# Altium schematic sheet Sheet1.SchDoc
size A3
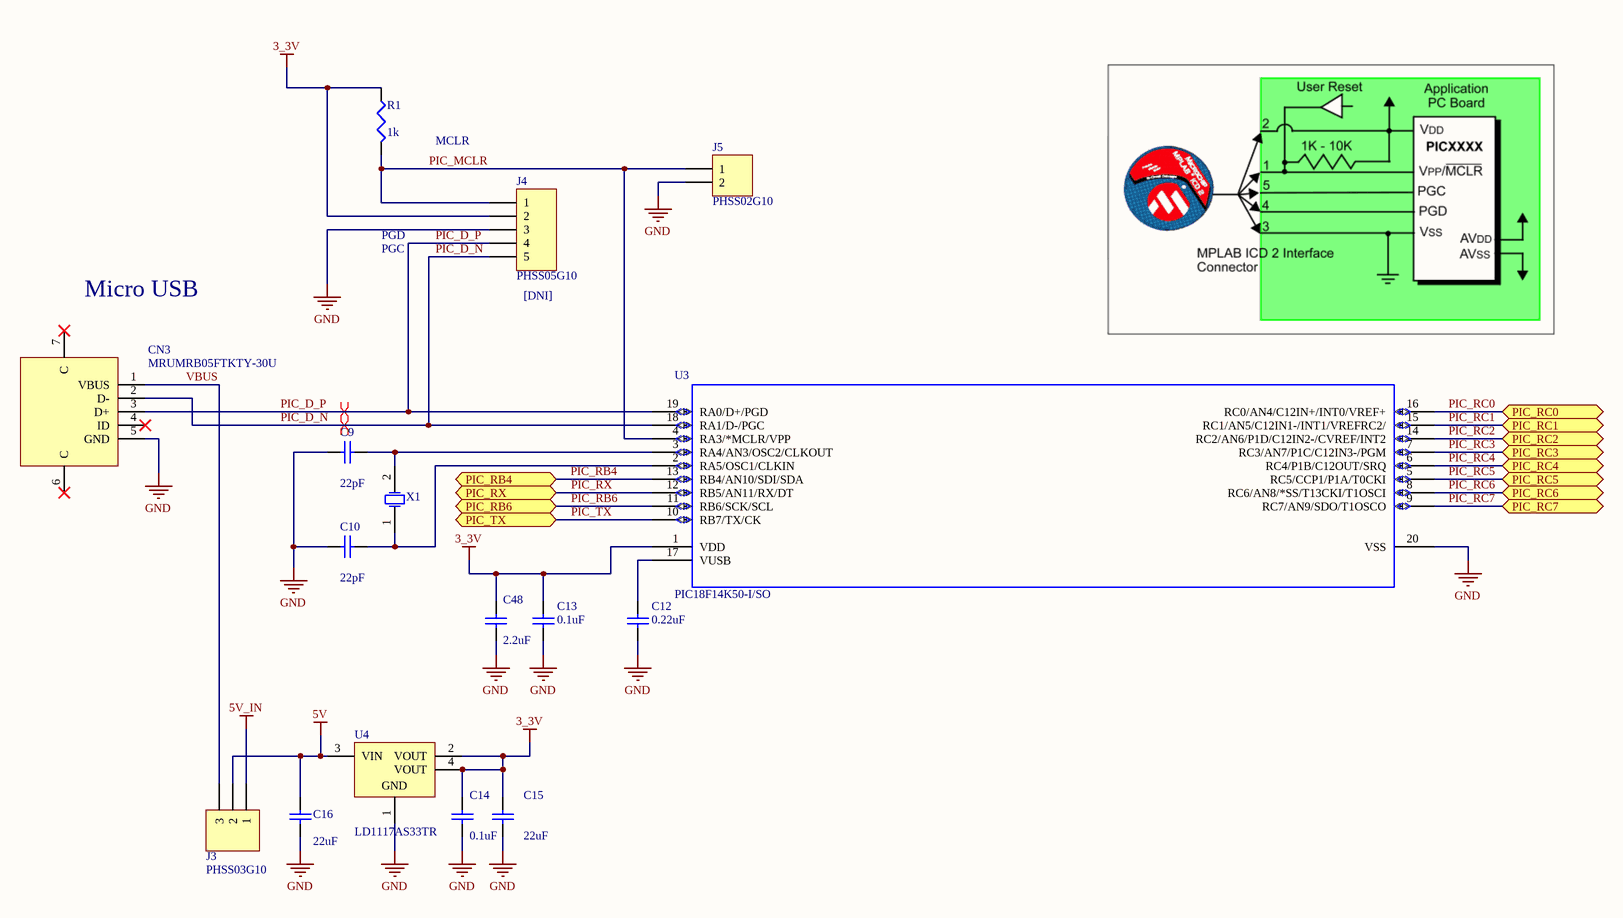
[diagram p0: Sheet1.SchDoc]

## Parts
C9  value 22pF  [CHIP1608]  (hidden comment: 06035A220JAT2A)
C10  value 22pF  [CHIP1608]  (hidden comment: 06035A220JAT2A)
C12  value 0.22uF  [CHIP1608]  (hidden comment: CC0603ZRY5V7BB224)
C13  value 0.1uF  [CHIP1608]  (hidden comment: MC0603B104M160CT)
C14  value 0.1uF  [CHIP1608]  (hidden comment: MC0603B104M160CT)
C15  value 22uF  [CHIP3216]  (hidden comment: MC1206F226Z100CT)
C16  value 22uF  [CHIP3216]  (hidden comment: MC1206F226Z100CT)
C48  value 2.2uF  [CHIP1608]  (hidden comment: MC0603B225K6R3CT)
CN3  MRUMRB05FTKTY-30U  [MRUMRB05FTKTY-30U]
J3  PHSS03G10  [HDR1X3]
J4  PHSS05G10  assembly: [DNI]  [HDR1X5]
J5  PHSS02G10  [HDR1X2]
R1  value 1k  [CHIP1608]  (hidden comment: MCMR06X1001FTL)
U3  PIC18F14K50-I/SO  [PIC18F14K50-SO]
U4  LD1117AS33TR  [SOT-223_N]
X1  SMD49S-12M1630F  [ABLS-25.000MHZ-B2F-T]  (value not drawn)

## Ports
PIC_RB4, PIC_RB6, PIC_RC0, PIC_RC1, PIC_RC2, PIC_RC3, PIC_RC4, PIC_RC5, PIC_RC6, PIC_RC7, PIC_RX, PIC_TX

## Nets
3_3V: C13.2 C14.2 C15.2 C48.2 J4.2 R1.1 U3.1(VDD) U4.2(VOUT) U4.4(VOUT)
5V: C16.2 J3.2 U4.3(VIN)
5V_IN: J3.1
GND: C9.1 C10.1 C12.1 C13.1 C14.1 C15.1 C16.1 C48.1 CN3.5(GND) J4.3 J5.2 U3.20(VSS) U4.1(GND)
PIC_D_N: CN3.2(D-) J4.5 U3.18(RA1/D-/PGC)
PIC_D_P: CN3.3(D+) J4.4 U3.19(RA0/D+/PGD)
PIC_MCLR: J4.1 J5.1 R1.2 U3.4(RA3/*MCLR/VPP)
PIC_RB4: U3.13(RB4/AN10/SDI/SDA) ; port PIC_RB4
PIC_RB6: U3.11(RB6/SCK/SCL) ; port PIC_RB6
PIC_RC0: U3.16(RC0/AN4/C12IN+/INT0/VREF+) ; port PIC_RC0
PIC_RC1: U3.15(RC1/AN5/C12IN1-/INT1/VREFRC2/) ; port PIC_RC1
PIC_RC2: U3.14(RC2/AN6/P1D/C12IN2-/CVREF/INT2) ; port PIC_RC2
PIC_RC3: U3.7(RC3/AN7/P1C/C12IN3-/PGM) ; port PIC_RC3
PIC_RC4: U3.6(RC4/P1B/C12OUT/SRQ) ; port PIC_RC4
PIC_RC5: U3.5(RC5/CCP1/P1A/T0CKI) ; port PIC_RC5
PIC_RC6: U3.8(RC6/AN8/*SS/T13CKI/T1OSCI) ; port PIC_RC6
PIC_RC7: U3.9(RC7/AN9/SDO/T1OSCO) ; port PIC_RC7
PIC_RX: U3.12(RB5/AN11/RX/DT) ; port PIC_RX
PIC_TX: U3.10(RB7/TX/CK) ; port PIC_TX
VBUS: CN3.1(VBUS) J3.3
NetC9_2: C9.2 U3.3(RA4/AN3/OSC2/CLKOUT) X1.2(OSC2)
NetC10_2: C10.2 U3.2(RA5/OSC1/CLKIN) X1.1(OSC1)
NetC12_2: C12.2 U3.17(VUSB)

Not connected (* = marked no-connect by the designer): CN3 4(ID)* 6(C)* 7(C)*

## Layout directives
differential pair: PIC_D_N, PIC_D_P

## Notes on the sheet
- MCLR
- PGD
- PGC
- Micro USB

## Library data of the parts
C9 C10 C13 = Cap Semi: Capacitor (Semiconductor SIM Model); Published: 8-Jun-2000; LatestRevisionDate: 17-Jul-2002; LatestRevisionNote: Re-released for DXP Platform.; PackageReference: C1206; Publisher: Altium Limited
  C9 C10: part2: CC0603JRNPO9BN220
  C13: part2: CC0603KRX7R9BB104
C12 C14-C16 C48 = Cap Semi: Capacitor (Semiconductor SIM Model); Vendor: element14(GTI); Published: 8-Jun-2000; LatestRevisionDate: 17-Jul-2002; LatestRevisionNote: Re-released for DXP Platform.; PackageReference: C1206; Publisher: Altium Limited
  C12: part2: CC0603KRX7R8BB224
  C14: part2: CC0603KRX7R9BB104
  C15 C16: part2: CC1206KKX5R8BB226
  C48: part2: CC0603KRX7R6BB225
CN3 = MicroUSBTypeB: Vendor: ES; part2: 10118192-0001LF
J3 = Header 3: Header, 3-Pin; Vendor: ES; LatestRevisionDate: 17-Jul-2002; LatestRevisionNote: Re-released for DXP Platform.; Publisher: Altium Limited
J4 = Header 5: Header, 5-Pin; Vendor: ES; LatestRevisionDate: 17-Jul-2002; LatestRevisionNote: Re-released for DXP Platform.; Publisher: Altium Limited
J5 = Header 2: Header, 2-Pin; Vendor: ES; LatestRevisionDate: 17-Jul-2002; LatestRevisionNote: Re-released for DXP Platform.; Publisher: Altium Limited
R1 = Res3: Resistor; Published: 8-Jun-2000; LatestRevisionDate: 04-Mar-2005; LatestRevisionNote: PCB Footprint replaced.; PackageReference: J1-0603; Publisher: Altium Limited; part2: RC0603JR-071KL
U3 = PIC18F14K50: MICROCHIPS; Vendor: ES; part2: PIC18F14K50-I/SO
U4 = LD1117AS33TR: 1A, Low Drop Positive Voltage Regulator, 3.3V, 4-Pin SOT-223, Tape and Reel; Vendor: ES; DatasheetVersion: Dec-2011; PackageVersion: 2010; PackageReference: SOT-223; PackageDescription: 4-Pin SOT-223 Package, 6.5 x 3.5 mm Body, 2.3 mm Pitch, 7 mm Lead Span; PartNumber: LD1117AS33TR; ComponentLink1Description: Manufacturer URL; ComponentLink1URL: http://www.st.com; ComponentLink2Description: Datasheet; ComponentLink2URL: http://www.st.com/internet/com/TECHNICAL_RESOURCES/TECHNICAL_LITERATURE/DATASHEET/CD00002116.pdf; part2: LD1117AS33TR
X1 = ABLS-25.000MHZ-B2F-T: MEC; Vendor: ES; part2: ABLS-12.000MHZ-B4-T